# Altium schematic sheet S7_LoRa.SchDoc
size A3
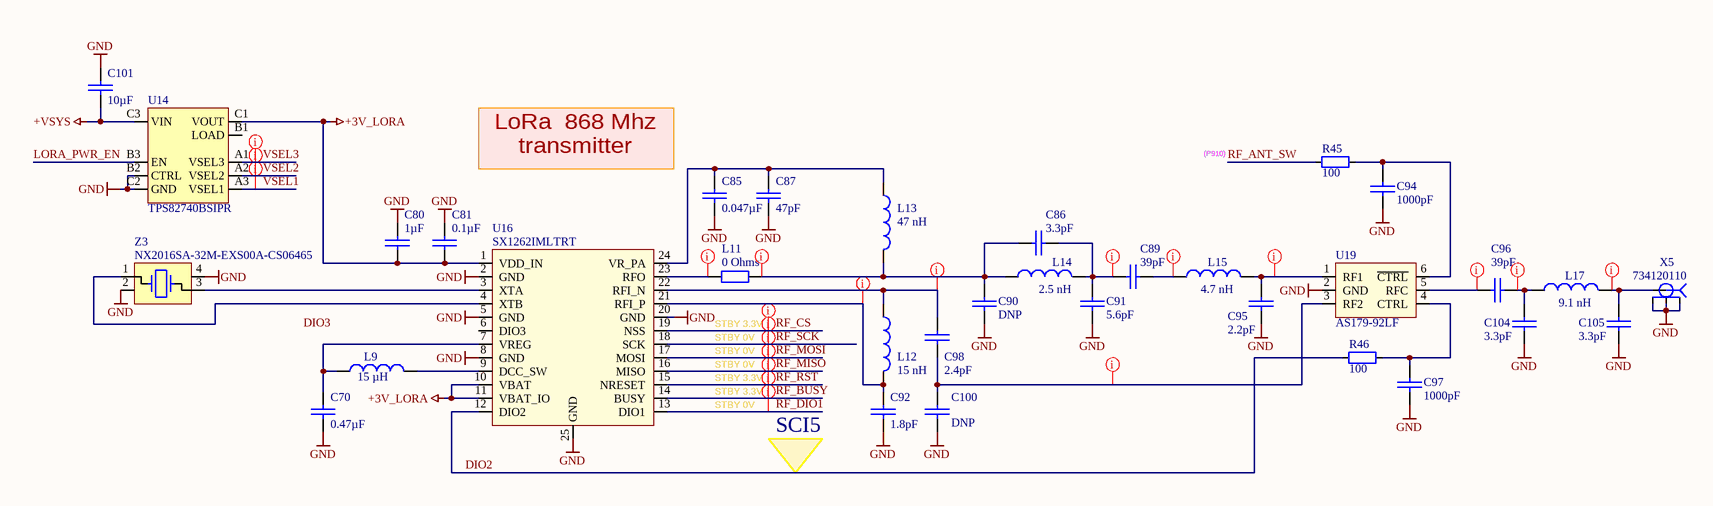
[diagram p0: S7_LoRa.SchDoc]

## Parts
C70  value 0.47µF  [0402 CAP]  (hidden comment: GRT155R61E474ME01D)
C80  value 1µF  [0402 CAP]  (hidden comment: TMK105BJ105MV-F)
C81  value 0.1µF  [0402 CAP]  (hidden comment: 0402B104K500CT)
C85  value 0.047µF  [0402 CAP]  (hidden comment: CC0402KRX7R8BB473)
C86  value 3.3pF  [0402 CAP]  (hidden comment: 885392005011)
C87  value 47pF  [0402 CAP]  (hidden comment: GJM1555C1H470FB01D)
C89  value 39pF  [0402 CAP]  (hidden comment: GJM1555C1H390JB01D)
C90  value DNP  [0402 CAP]  (hidden comment: Capacitor_0402)  (no BOM)
C91  value 5.6pF  [0402 CAP]  (hidden comment: GJM1555C1H5R6BB01D)
C92  value 1.8pF  [0402 CAP]  (hidden comment: GJM1555C1H1R8BB01D)
C94  value 1000pF  [0402 CAP]  (hidden comment: C1005CH1H102J050BA)
C95  value 2.2pF  [0402 CAP]  (hidden comment: CBR04C229B5GAC)
C96  value 39pF  [0402 CAP]  (hidden comment: GJM1555C1H390JB01D)
C97  value 1000pF  [0402 CAP]  (hidden comment: C1005CH1H102J050BA)
C98  value 2.4pF  [0402 CAP]  (hidden comment: GJM1555C1H2R4BB01D)
C100  value DNP  [0402 CAP]  (hidden comment: Capacitor_0402)  (no BOM)
C101  value 10µF  [0603 CAP]  (hidden comment: GRT188R61C106KE13D)
C104  value 3.3pF  [0402 CAP]  (hidden comment: 885392005011)
C105  value 3.3pF  [0402 CAP]  (hidden comment: 885392005011)
L9  value 15 µH  [2012[0805]]  (hidden comment: LQM21DH150M70L)
L11  value 0 Ohms  [INDC1005-0402]  (hidden comment: CRCW04020000Z0ED)
L12  value 15 nH  [INDC1005-0402]  (hidden comment: LQW15AN15NH00D)
L13  value 47 nH  [INDC1005-0402]  (hidden comment: LQW15AN47NJ00D)
L14  value 2.5 nH  [INDC1005-0402]  (hidden comment: LQW15AN2N5C00D)
L15  value 4.7 nH  [INDC1005-0402]  (hidden comment: LQW15AN4N7C00D)
L17  value 9.1 nH  [INDC1005-0402]  (hidden comment: LQW15AN9N1H00D)
R45  value 100  [0402]  (hidden comment: RMCF0402FT100R)
R46  value 100  [0402]  (hidden comment: RMCF0402FT100R)
U14  TPS82740BSIPR  [MicroSiP]
U16  SX1262IMLTRT  [VQFN24]
U19  AS179-92LF  [SC70-6]
X5  734120110  [0734120110]
Z3  NX2016SA-32M-EXS00A-CS06465  [4-SMD 2.00mm x 1.60mm]

## Nets
+3V_LORA: C80.2 C81.2 U14.C1(VOUT) U16.1(VDD_IN) U16.10(VBAT) U16.11(VBAT_IO)
+VSYS: C101.2 U14.C3(VIN)
GND: C70.2 C80.1 C81.1 C85.2 C87.2 C90.2 C91.2 C92.2 C94.1 C95.2 C97.1 C100.2 C101.1 C104.1 C105.1 U14.B2(CTRL) U14.C2(GND) U16.2(GND) U16.5(GND) U16.8(GND) U16.20(GND) U16.25(GND) U19.2(GND) X5.2 X5.3 X5.4 Z3.2 Z3.4
DIO2: R46.2 U16.12(DIO2)
LORA_PWR_EN: U14.B3(EN)
RF_ANT_SW: R45.2
RF_BUSY: U16.14(BUSY)
RF_CS: U16.19(NSS)
RF_DIO1: U16.13(DIO1)
RF_MISO: U16.16(MISO)
RF_MOSI: U16.17(MOSI)
RF_RST: U16.15(NRESET)
RF_SCK: U16.18(SCK)
VSEL1: U14.A3(VSEL1)
VSEL2: U14.A2(VSEL2)
VSEL3: U14.A1(VSEL3)
NetC70_1: C70.1 L9.1 U16.7(VREG)
NetC85_1: C85.1 C87.1 L13.1 U16.24(VR_PA)
NetC86_1: C86.1 C90.1 L11.2 L13.2 L14.1
NetC86_2: C86.2 C89.1 C91.1 L14.2
NetC89_2: C89.2 L15.1
NetC92_1: C92.1 L12.2 U16.21(RFI_P)
NetC94_2: C94.2 R45.1 U19.6(~{CTRL})
NetC95_1: C95.1 L15.2 U19.1(RF1)
NetC96_1: C96.1 U19.5(RFC)
NetC96_2: C96.2 C104.2 L17.1
NetC97_2: C97.2 R46.1 U19.4(CTRL)
NetC98_1: C98.1 L12.1 U16.22(RFI_N)
NetC98_2: C98.2 C100.1 U19.3(RF2)
NetC105_2: C105.2 L17.2 X5.1(Sig)
NetL9_2: L9.2 U16.9(DCC_SW)
NetL11_1: L11.1 U16.23(RFO)
NetU16_3: U16.3(XTA) Z3.3
NetU16_4: U16.4(XTB) Z3.1

Not connected (* = marked no-connect by the designer): U14 B1(LOAD); U16 6(DIO3)

## Layout directives
net class RF: NetC86_1, NetC86_2, NetC89_2, NetC92_1, NetC95_1, NetC96_1, NetC96_2, NetC98_1, NetC98_2, NetC105_2, NetL11_1
net class VSEL: VSEL1, VSEL2, VSEL3
net class LoRa: RF_BUSY, RF_CS, RF_DIO1, RF_MISO, RF_MOSI, RF_RST, RF_SCK

## Notes on the sheet
- (near C85) LoRa  868 Mhz transmitter
- (P910)
- STBY 3.3V
- STBY 0V
- SCI5
- Labels drawn without touching a wire or pin: DIO3

## Library data of the parts
C70 = GRT155R61E474ME01D: 0.47µF, ±20%, 25V, X5R, 0402 (1005 Metric), -55°C ~ 85°C, -, Automotive; Manufacturer: Murata Electronics North America; PartNum: 490-12270-1-ND; Voltage - Rated: 25V; Part Number: GRT155R61E474ME01D; Distributor: Digi-Key; PartName: GRT155R61E474ME01D; Price: 0.13000; Tolerance: ±20%; Temperature Coefficient: X5R; Operating Temperature: -55°C ~ 85°C; Features: -; Package / Case: 0402 (1005 Metric)
C80 = TMK105BJ105MV-F: 1µF, ±20%, 25V, X5R, 0402 (1005 Metric), -55°C ~ 85°C, -, General Purpose; Manufacturer: Taiyo Yuden; PartNum: 587-3245-1-ND; Voltage - Rated: 25V; Part Number: TMK105BJ105MV-F; Distributor: Digi-Key; PartName: TMK105BJ105MV-F; Price: 0.22000; Tolerance: ±20%; Temperature Coefficient: X5R; Operating Temperature: -55°C ~ 85°C; Features: -; Package / Case: 0402 (1005 Metric)
C81 = 0402B104K500CT: 0.1µF, ±10%, 50V, X7R, 0402 (1005 Metric), -55°C ~ 125°C, -, General Purpose; Manufacturer: Walsin Technology Corporation; PartNum: 1292-1176-1-ND; Voltage - Rated: 50V; Part Number: 0402B104K500CT; Distributor: Digi-Key; PartName: 0402B104K500CT; Price: 0.19000; Tolerance: ±10%; Temperature Coefficient: X7R; Operating Temperature: -55°C ~ 125°C; Features: -; Package / Case: 0402 (1005 Metric)
C85 = CC0402KRX7R8BB473: 0.047µF, ±10%, 25V, X7R, 0402 (1005 Metric), -55°C ~ 125°C, -, General Purpose; Manufacturer: Yageo; PartNum: 311-1717-1-ND; Voltage - Rated: 25V; Part Number: CC0402KRX7R8BB473; Distributor: Digi-Key; PartName: CC0402KRX7R8BB473; Price: 0.10000; Tolerance: ±10%; Temperature Coefficient: X7R; Operating Temperature: -55°C ~ 125°C; Features: -; Package / Case: 0402 (1005 Metric)
C86 C104 C105 = 885392005011: 3.3pF, ±0.1pF, 50V, C0G, NP0, 0402 (1005 Metric), -55°C ~ 125°C, -, RF, Microwave, High Frequency; Manufacturer: Wurth Electronics Inc.; PartNum: 732-13236-1-ND; Voltage - Rated: 50V; Part Number: 885392005011; Distributor: Digi-Key; PartName: 885392005011; Price: 0.10000; Tolerance: ±0.1pF; Temperature Coefficient: C0G, NP0; Operating Temperature: -55°C ~ 125°C; Features: -; Package / Case: 0402 (1005 Metric)
C87 = GJM1555C1H470FB01D: 47pF, ±1%, 50V, C0G, NP0, 0402 (1005 Metric), -55°C ~ 125°C, High Q, Low Loss, RF, Microwave, High Frequency; Manufacturer: Murata Electronics North America; PartNum: 490-16376-1-ND; Voltage - Rated: 50V; Part Number: GJM1555C1H470FB01D; Distributor: Digi-Key; PartName: GJM1555C1H470FB01D; Price: 0.28000; Tolerance: ±1%; Temperature Coefficient: C0G, NP0; Operating Temperature: -55°C ~ 125°C; Features: High Q, Low Loss; Package / Case: 0402 (1005 Metric)
C89 C96 = GJM1555C1H390JB01D: 39pF, ±5%, 50V, C0G, NP0, 0402 (1005 Metric), -55°C ~ 125°C, High Q, Low Loss, RF, Microwave, High Frequency; Manufacturer: Murata Electronics North America; PartNum: 490-17673-1-ND; Voltage - Rated: 50V; Part Number: GJM1555C1H390JB01D; Distributor: Digi-Key; PartName: GJM1555C1H390JB01D; Price: 0.24000; Tolerance: ±5%; Temperature Coefficient: C0G, NP0; Operating Temperature: -55°C ~ 125°C; Features: High Q, Low Loss; Package / Case: 0402 (1005 Metric)
C91 = GJM1555C1H5R6BB01D: 5.6pF, ±0.1pF, 50V, C0G, NP0, 0402 (1005 Metric), -55°C ~ 125°C, High Q, Low Loss, RF, Microwave, High Frequency; Manufacturer: Murata Electronics North America; PartNum: 490-11225-1-ND; Voltage - Rated: 50V; Part Number: GJM1555C1H5R6BB01D; Distributor: Digi-Key; PartName: GJM1555C1H5R6BB01D; Price: 0.19000; Tolerance: ±0.1pF; Temperature Coefficient: C0G, NP0; Operating Temperature: -55°C ~ 125°C; Features: High Q, Low Loss; Package / Case: 0402 (1005 Metric)
C92 = GJM1555C1H1R8BB01D: 1.8pF, ±0.1pF, 50V, C0G, NP0, 0402 (1005 Metric), -55°C ~ 125°C, High Q, Low Loss, RF, Microwave, High Frequency; Manufacturer: Murata Electronics North America; PartNum: 490-8089-1-ND; Voltage - Rated: 50V; Part Number: GJM1555C1H1R8BB01D; Distributor: Digi-Key; PartName: GJM1555C1H1R8BB01D; Price: 0.19000; Tolerance: ±0.1pF; Temperature Coefficient: C0G, NP0; Operating Temperature: -55°C ~ 125°C; Features: High Q, Low Loss; Package / Case: 0402 (1005 Metric)
C94 C97 = C1005CH1H102J050BA: 1000pF, ±5%, 50V, CH, 0402 (1005 Metric), -25°C ~ 85°C, Low ESL, General Purpose; Manufacturer: TDK Corporation; PartNum: 445-10829-1-ND; Voltage - Rated: 50V; Part Number: C1005CH1H102J050BA; Distributor: Digi-Key; PartName: C1005CH1H102J050BA; Price: 0.19000; Tolerance: ±5%; Temperature Coefficient: CH; Operating Temperature: -25°C ~ 85°C; Features: Low ESL; Package / Case: 0402 (1005 Metric)
C95 = CBR04C229B5GAC: 2.2pF, ±0.1pF, 50V, C0G, NP0, 0402 (1005 Metric), -55°C ~ 125°C, High Q, Low Loss, RF, Microwave, High Frequency; Manufacturer: KEMET; PartNum: 399-17527-1-ND; Voltage - Rated: 50V; Part Number: CBR04C229B5GAC; Distributor: Digi-Key; PartName: CBR04C229B5GAC; Price: 0.19000; Tolerance: ±0.1pF; Temperature Coefficient: C0G, NP0; Operating Temperature: -55°C ~ 125°C; Features: High Q, Low Loss; Package / Case: 0402 (1005 Metric)
C98 = GJM1555C1H2R4BB01D: 2.4pF, ±0.1pF, 50V, C0G, NP0, 0402 (1005 Metric), -55°C ~ 125°C, High Q, Low Loss, RF, Microwave, High Frequency; Manufacturer: Murata Electronics North America; PartNum: 490-8093-1-ND; Voltage - Rated: 50V; Part Number: GJM1555C1H2R4BB01D; Distributor: Digi-Key; PartName: GJM1555C1H2R4BB01D; Price: 0.19000; Tolerance: ±0.1pF; Temperature Coefficient: C0G, NP0; Operating Temperature: -55°C ~ 125°C; Features: High Q, Low Loss; Package / Case: 0402 (1005 Metric)
C101 = GRT188R61C106KE13D: 10µF, ±10%, 16V, X5R, 0603 (1608 Metric), -55°C ~ 85°C, -, Automotive; Manufacturer: Murata Electronics North America; PartNum: 490-12317-1-ND; Voltage - Rated: 16V; Part Number: GRT188R61C106KE13D; Distributor: Digi-Key; PartName: GRT188R61C106KE13D; Price: 0.22770; Tolerance: ±10%; Temperature Coefficient: X5R; Operating Temperature: -55°C ~ 85°C; Features: -; Package / Case: 0603 (1608 Metric)
L9 = LQM21DH150M70L: 15 µH Shielded Multilayer Inductor 250 mA, 1.235Ohm, 24MHz Max 0805 (2012 Metric); Manufacturer: Murata Electronics; PartNum: 490-LQM21DH150M70LCT-ND; Tolerance: ±20%; Distributor: Digi-Key; Price: 0.16$; PartName: LQM21DH150M70L
L11 = CRCW04020000Z0ED: 0 Ohms Jumper 0.063W, 1/16W Chip Resistor 0402 (1005 Metric) Automotive AEC-Q200 Thick Film; Manufacturer: Vishay Dale; PartNum: 541-0.0JCT-ND; Distributor: Digi-Key; PartName: CRCW04020000Z0ED
L12 = LQW15AN15NH00D: 15nH Unshielded Wirewound Inductor 460mA 160 mOhm Max 0402 (1006 Metric); Manufacturer: Murata; PartNum: 490-6772-1-ND; Tolerance: ±3%; Distributor: Digi-Key; PartName: LQW15AN15NH00D
L13 = LQW15AN47NJ00D: 47nH Unshielded Wirewound Inductor 210mA 1.08 Ohm Max 0402 (1005 Metric); Manufacturer: Murata; PartNum: 490-1154-1-ND; Tolerance: ±5%; Distributor: Digi-Key; PartName: LQW15AN47NJ00D
L14 = LQW15AN2N5C00D: 2.5nH Unshielded Wirewound Inductor 850mA 50 mOhm Max 0402 (1006 Metric); Manufacturer: Murata; PartNum: 490-6798-1-ND; Tolerance: ±0.2nH; Distributor: Digi-Key; PartName: LQW15AN2N5C00D
L15 = LQW15AN4N7C00D: 4.7nH Unshielded Wirewound Inductor 750mA 70 mOhm Max 0402 (1006 Metric); Manufacturer: Murata Electronics North America; PartNum: 490-1139-1-ND; Tolerance: ±0.2nH; Distributor: Digi-Key; PartName: LQW15AN4N7C00D
L17 = LQW15AN9N1H00D: 9.1nH Unshielded Wirewound Inductor 540mA 140 mOhm Max 0402 (1006 Metric); Manufacturer: Murata Electronics North America; PartNum: 490-8444-1-ND; Tolerance: ±3%; Distributor: Digi-Key; PartName: LQW15AN9N1H00D
R45 R46 = RMCF0402FT100R: 100 Ohms, ±1%, 0.063W, 1/16W, Thick Film, ±100ppm/°C, 0402 (1005 Metric), -55°C ~ 155°C, Automotive AEC-Q200; Manufacturer: Stackpole Electronics Inc; PartNum: RMCF0402FT100RCT-ND; Voltage: 75V; Distributor: Digi-Key; Price: 0.10000; Tolerance: ±1%; PartName: RMCF0402FT100R; Part Number: RMCF0402FT100R; Temperature Coefficient: ±100ppm/°C; Operating Temperature: -55°C ~ 155°C; Power (Watts): 0.063W, 1/16W; Features: Automotive AEC-Q200; Package / Case: 0402 (1005 Metric)
U14 = TPS82740BSIPR: Non-Isolated PoL Module DC DC Converter 1 Output 2.6 ~ 3.3V 200mA 2.2V - 5.5V Input, 3.0mm x 2.4mm x 1.0mm, -40...85 C; Manufacturer: Texas Instruments; PartNum: 296-46481-1-ND; Distributor: Digi-Key; price: 2.88$; PartName: TPS82740BSIPR
U16 = SX1262IMLTRT: IC RF TxRx Only General ISM < 1GHz LoRaWAN 150MHz ~ 960MHz 24-VFQFN Exposed Pad; Manufacturer: Semtech Corporation; PartName: SX1262IMLTRTCT-ND; Distributor: Digi-Key; PartNum: SX1262IMLTRT; Price: 7.94$
U19 = AS179-92LF: RF Switch IC 802.11b, g, Bluetooth, WLAN SPDT 3 GHz 50Ohm SC-70-6, -40°C ~ 85°C; Manufacturer: Skyworks Solutions Inc.; PartNum: 863-1003-1-ND; Distributor: Digi-Key; PartName: AS179-92LF
X5 = 0734120110: U.FL (UMCC) Connector Receptacle, Male Pin 50 Ohm Surface Mount Solder; Manufacturer: Molex; PartNum: WM5587TR-ND; Distributor: Digi-Key; PartName: 0734120110
Z3 = NX2016SA-32M-EXS00A-CS06465: 32 MHz Crystal 10pF,  60 Ohms, 10 ppm,  4-SMD, No Lead, -40...+85 С; Manufacturer: NDK America, Inc.; PartNum: 644-1300-1-ND; Tolerance: ±1ppm; Value: 32 MHz; Distributor: Digi-Key; Price: 0.38$; PartName: NX2016SA-32M-EXS00A-CS06465